# Altium schematic sheet A_INPUT.SchDoc
size A; SheetNumber: 5; SheetTotal: 9
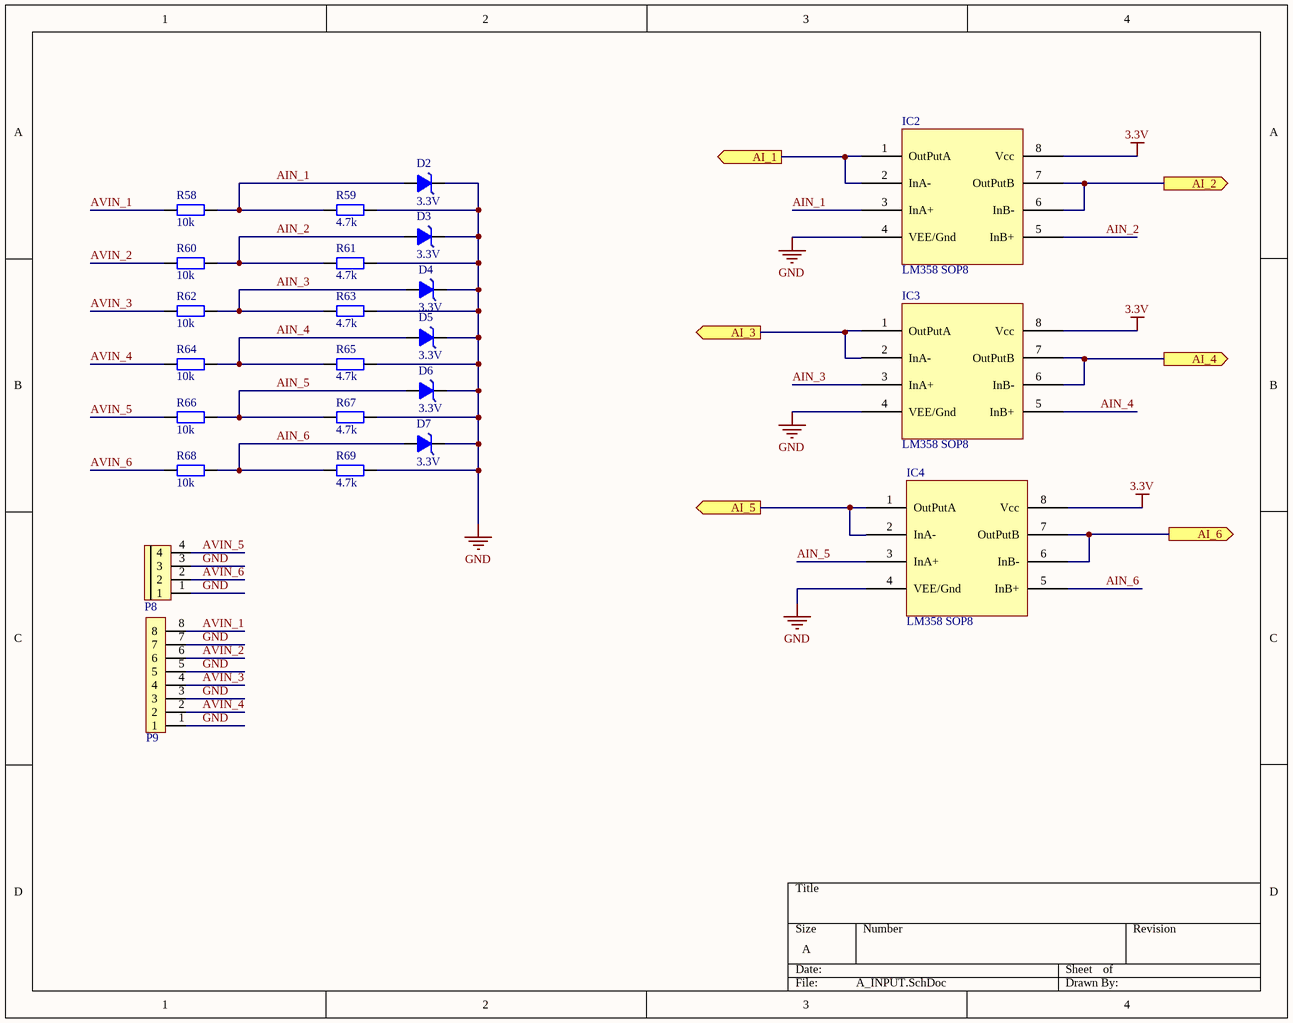
[diagram p0: A_INPUT.SchDoc]

## Parts
D2  3.3V  [DIODE ZENNER SMD SOD80]
D3  3.3V  [DIODE ZENNER SMD SOD80]
D4  3.3V  [DIODE ZENNER SMD SOD80]
D5  3.3V  [DIODE ZENNER SMD SOD80]
D6  3.3V  [DIODE ZENNER SMD SOD80]
D7  3.3V  [DIODE ZENNER SMD SOD80]
IC2  LM358 SOP8  [SOP 8]
IC3  LM358 SOP8  [SOP 8]
IC4  LM358 SOP8  [SOP 8]
P8  CON 4 EDG5.08  [CON 4 4EDG5.08]  (value not drawn)
P9  CON 8 EDG5.08  [CON 8 8EDG5.08]  (value not drawn)
R58  10k  [tro smd 0805]
R59  4.7k  [tro smd 0805]
R60  10k  [tro smd 0805]
R61  4.7k  [tro smd 0805]
R62  10k  [tro smd 0805]
R63  4.7k  [tro smd 0805]
R64  10k  [tro smd 0805]
R65  4.7k  [tro smd 0805]
R66  10k  [tro smd 0805]
R67  4.7k  [tro smd 0805]
R68  10k  [tro smd 0805]
R69  4.7k  [tro smd 0805]

## Ports
AI_1 (out), AI_2 (out), AI_3 (out), AI_4 (out), AI_5 (out), AI_6 (out)

## Nets
3.3V: IC2.8(Vcc) IC3.8(Vcc) IC4.8(Vcc)
GND: D2.2(K) D3.2(K) D4.2(K) D5.2(K) D6.2(K) D7.2(K) IC2.4(VEE/Gnd) IC3.4(VEE/Gnd) IC4.4(VEE/Gnd) P8.1 P8.3 P9.1 P9.3 P9.5 P9.7 R59.1 R61.1 R63.1 R65.1 R67.1 R69.1
AI_1: IC2.1(OutPutA) IC2.2(InA-) ; port AI_1
AI_2: IC2.6(InB-) IC2.7(OutPutB) ; port AI_2
AI_3: IC3.1(OutPutA) IC3.2(InA-) ; port AI_3
AI_4: IC3.6(InB-) IC3.7(OutPutB) ; port AI_4
AI_5: IC4.1(OutPutA) IC4.2(InA-) ; port AI_5
AI_6: IC4.6(InB-) IC4.7(OutPutB) ; port AI_6
AIN_1: D2.1(A) IC2.3(InA+) R58.1 R59.2
AIN_2: D3.1(A) IC2.5(InB+) R60.1 R61.2
AIN_3: D4.1(A) IC3.3(InA+) R62.1 R63.2
AIN_4: D5.1(A) IC3.5(InB+) R64.1 R65.2
AIN_5: D6.1(A) IC4.3(InA+) R66.1 R67.2
AIN_6: D7.1(A) IC4.5(InB+) R68.1 R69.2
AVIN_1: P9.8 R58.2
AVIN_2: P9.6 R60.2
AVIN_3: P9.4 R62.2
AVIN_4: P9.2 R64.2
AVIN_5: P8.4 R66.2
AVIN_6: P8.2 R68.2

## Library data of the parts
D2-D7 = Diode Zener 3.3V: Dán; Don_Vi: Con; Ma_Hang: MH002880; Ten_Linh_Kien: Diode Zener 1/2W 3.3V SMD1206 ZMM3.3; Kieu_Chan: *; Ghi_Chu: *; Chung_Loai: Dán
IC2-IC4 = LM358 SOP8: Dán; Ma_Hang: MH000609; Don_Vi: Con; Ten_Linh_Kien: LM358 SOP8; Kieu_Chan: *; Ghi_Chu: *; Chung_Loai: Dán
P8 = CON 4 EDG5.08: Cắm; Ten_Linh_Kien: CON 4 2EDG5.08-4P 5.08MM ( Xanh Cong); Ma_Hang: MH000979; Don_Vi: Con; Ghi_Chu: *; Kieu_Chan: *; Chung_Loai: Cắm
P9 = CON 8 EDG5.08: Cắm; Ten_Linh_Kien: CON 8 2EDG5.08-8P 5.08MM ( Xanh Cong); Ma_Hang: MH000978; Don_Vi: Con; Ghi_Chu: *; Kieu_Chan: *; Chung_Loai: Cắm
R58 R60 R62 R64 R66 R68 = Tro 0805 5% 10k: Dán; Don_Vi: Con; So_Chan: 2; Ten_Linh_Kien: Trở 0805 5% 10k; Ma_Hang: MH005239; Chung_Loai: Dán; Kieu_Chan: *
R59 R61 R63 R65 R67 R69 = Tro 0805 5% 4.7k: Dán; Don_Vi: Con; So_Chan: 2; Ten_Linh_Kien: Trở 0805 5% 4.7k; Ma_Hang: MH005307; Chung_Loai: Dán; Kieu_Chan: *